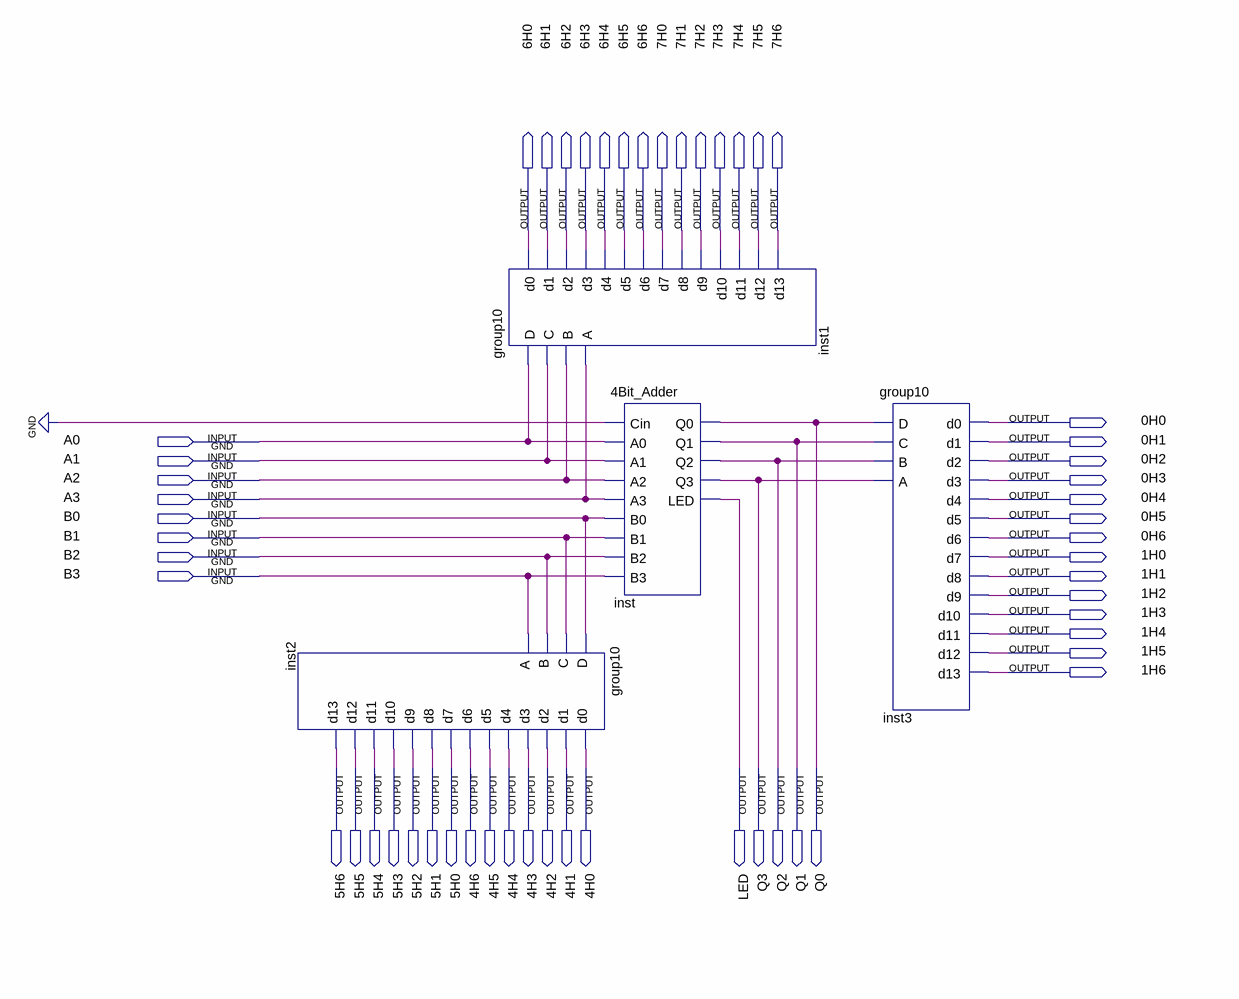
[diagram p0: schematic sheet]
// Quartus schematic Adder_Display.bdf as structural Verilog: 4 symbols, 55 pins
module Adder_Display (
  input  A0,
  input  A1,
  input  A2,
  input  A3,
  input  B0,
  input  B1,
  input  B2,
  input  B3,
  output \6H0 ,
  output \6H1 ,
  output \6H2 ,
  output \6H3 ,
  output \6H4 ,
  output \6H5 ,
  output \6H6 ,
  output \7H0 ,
  output \7H1 ,
  output \7H2 ,
  output \7H3 ,
  output \7H4 ,
  output \7H5 ,
  output \7H6 ,
  output \0H0 ,
  output \0H1 ,
  output \0H2 ,
  output \0H3 ,
  output \0H4 ,
  output \0H5 ,
  output \0H6 ,
  output \1H0 ,
  output \1H1 ,
  output \1H2 ,
  output \1H3 ,
  output \1H4 ,
  output \1H5 ,
  output \1H6 ,
  output \5H6 ,
  output \5H5 ,
  output \5H4 ,
  output \5H3 ,
  output \5H2 ,
  output \5H1 ,
  output \5H0 ,
  output \4H6 ,
  output \4H5 ,
  output \4H4 ,
  output \4H3 ,
  output \4H2 ,
  output \4H1 ,
  output \4H0 ,
  output LED,
  output Q3,
  output Q2,
  output Q1,
  output Q0
);

  group10 inst2 (
    .D(B0), .C(B1), .B(B2), .A(B3), .d0(\4H0 ), .d1(\4H1 ), .d2(\4H2 ), .d3(\4H3 ), .d4(\4H4 ), .d5(\4H5 ),
    .d6(\4H6 ), .d7(\5H0 ), .d8(\5H1 ), .d9(\5H2 ), .d10(\5H3 ), .d11(\5H4 ), .d12(\5H5 ), .d13(\5H6 ));
  group10 inst1 (
    .D(A0), .C(A1), .B(A2), .A(A3), .d0(\6H0 ), .d1(\6H1 ), .d2(\6H2 ), .d3(\6H3 ), .d4(\6H4 ), .d5(\6H5 ),
    .d6(\6H6 ), .d7(\7H0 ), .d8(\7H1 ), .d9(\7H2 ), .d10(\7H3 ), .d11(\7H4 ), .d12(\7H5 ), .d13(\7H6 ));
  \4Bit_Adder  inst (
    .Cin(1'b0), .A0(A0), .A1(A1), .A2(A2), .A3(A3), .B0(B0), .B1(B1), .B2(B2), .B3(B3), .Q0(Q0), .Q1(Q1),
    .Q2(Q2), .Q3(Q3), .LED(LED));
  group10 inst3 (
    .D(Q0), .C(Q1), .B(Q2), .A(Q3), .d0(\0H0 ), .d1(\0H1 ), .d2(\0H2 ), .d3(\0H3 ), .d4(\0H4 ), .d5(\0H5 ),
    .d6(\0H6 ), .d7(\1H0 ), .d8(\1H1 ), .d9(\1H2 ), .d10(\1H3 ), .d11(\1H4 ), .d12(\1H5 ), .d13(\1H6 ));
endmodule
